# Altium schematic sheet 超声波模块云台原理图.SchDoc: 超声波模块
size A4; Author: 廖蒙林; Engineer: 廖蒙林; DocumentNumber: 1; Revision: 01
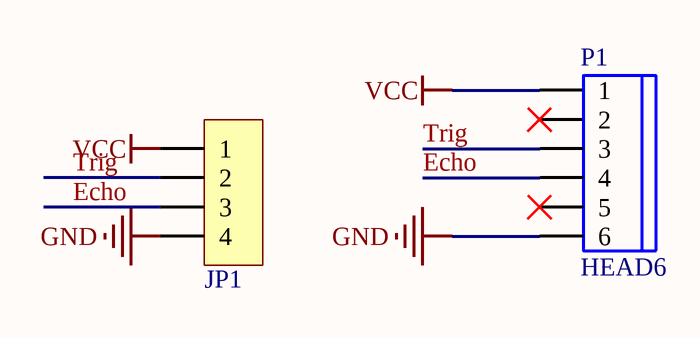
[diagram p0: 超声波模块云台原理图.SchDoc]

## Parts
JP1  HDR-1X4  [HDR2.54-LI-4P]  (value not drawn)
P1  HEAD6  [SH1.0-6P]

## Nets
GND: JP1.4 P1.6
VCC: JP1.1 P1.1
Echo: JP1.3 P1.4
Trig: JP1.2 P1.3

Not connected (* = marked no-connect by the designer): P1 2* 5*

## Notes on the sheet
- Title
- Size:
- Date:
- A4
- Number:
- Time:
- Revision:
- Sheet
- of
- File:

## Library data of the parts
JP1 = Header 4: 4P接插件; 版权归属: 封装库来自淘宝 ID：黄晶宝石; BOM名称: 4P接插件; 学习资源: https://shop463601444.taobao.com